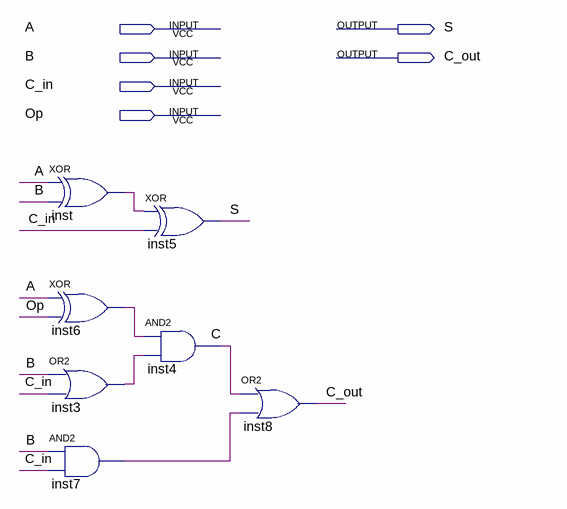
[diagram p0: schematic sheet]
// Quartus schematic 1BitAdderSubtractor.bdf as structural Verilog: 7 symbols, 6 pins
module \1BitAdderSubtractor  (
  input  A,
  input  B,
  input  C_in,
  input  Op,
  output S,
  output C_out
);

  wire C, inst3_out, inst6_out, inst7_out, inst_out;

  xor inst (inst_out, A, B);
  xor inst6 (inst6_out, A, Op);
  or inst3 (inst3_out, B, C_in);
  and inst7 (inst7_out, B, C_in);
  xor inst5 (S, inst_out, C_in);
  and inst4 (C, inst6_out, inst3_out);
  or inst8 (C_out, C, inst7_out);
endmodule
